# Altium project Ground Support.PrjPcb
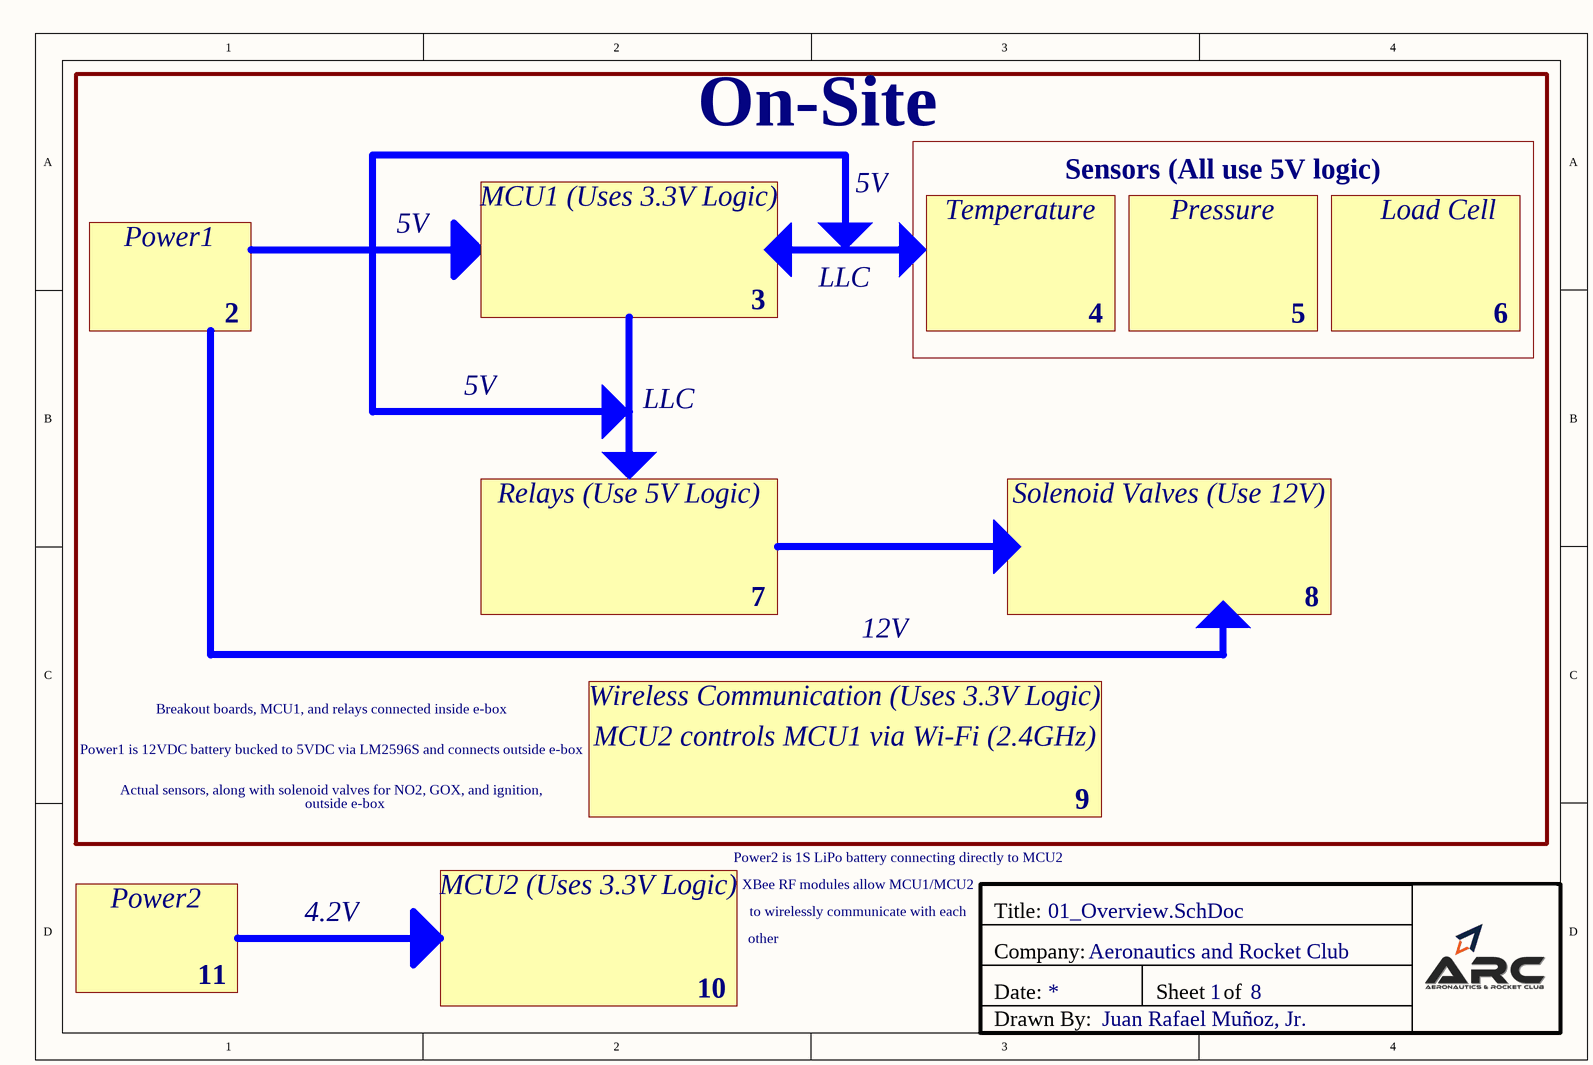
[diagram p0: 01_Overview.SchDoc]
Author: Juan Rafael Muñoz, Jr.; CompanyName: Aeronautics and Rocket Club
7 sheets, 23 parts. Net scope: flat (ports and power ports of the same name join across sheets).
Board file: GroundSupport.PcbDoc
Sheets:
  01_Overview.SchDoc
  02_Power1.SchDoc
  03_MCU1.SchDoc
  04_Temperature.SchDoc
  05_Pressure_and_LoadCell.SchDoc
  06_Relays_and_SolenoidValves.SchDoc
  09_Ebox_PhysicalConnections.SchDoc

## Sheet 01_Overview.SchDoc
size A4; DocumentNumber: 1; SheetNumber: 1; SheetTotal: 8

### Notes on the sheet
- On-Site
- MCU1 (Uses 3.3V Logic)
- 5V
- Temperature
- Sensors (All use 5V logic)
- Pressure
- Load Cell
- Power1
- LLC
- 2
- 3
- 4
- 5
- 6
- Relays (Use 5V Logic)
- Solenoid Valves (Use 12V)
- 7
- 8
- 12V
- Breakout boards, MCU1, and relays connected inside e-box
- Power1 is 12VDC battery bucked to 5VDC via LM2596S and connects outside e-box
- Wireless Communication (Uses 3.3V Logic)
- MCU2 controls MCU1 via Wi-Fi (2.4GHz)
- Actual sensors, along with solenoid valves for NO2, GOX, and ignition,
- outside e-box
- 9
- MCU2 (Uses 3.3V Logic)
- XBee RF modules allow MCU1/MCU2
- Power2 is 1S LiPo battery connecting directly to MCU2
- Power2
- 4.2V
- other
- to wirelessly communicate with each
- 11
- 10
- Title:
- Company:
- Date:
- Sheet
- of
- Drawn By:

## Sheet 02_Power1.SchDoc
size A4; DocumentNumber: 2; SheetNumber: 2; SheetTotal: 7
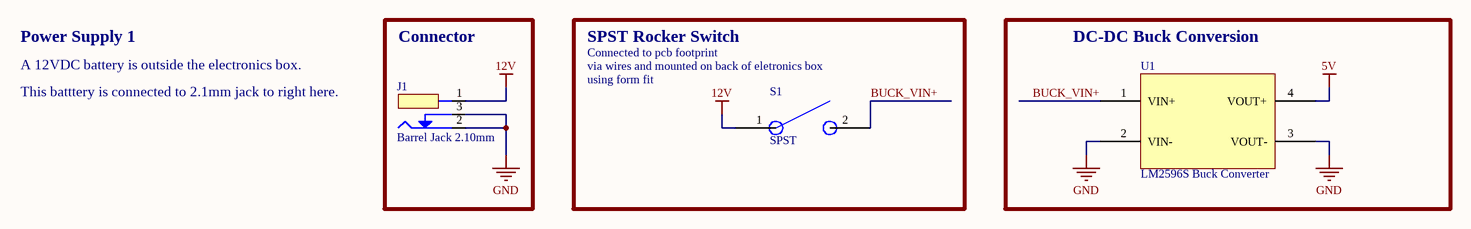
[diagram p1: 02_Power1.SchDoc]

### Parts
J1  Barrel Jack 2.10mm  [2.1mm Barrel Jack Connector]
S1  SPST  [SPST Switch]
U1  LM2596S Buck Converter  [LM2596S Buck Converter]

### Blocks framed on the sheet
Connector: J1
SPST Rocker Switch: S1
DC-DC Buck Conversion: U1

### Nets
5V: U1.4(VOUT+)
12V: J1.1 S1.1(+)
GND: J1.2 J1.3 U1.2(VIN-) U1.3(VOUT-)
BUCK_VIN+: S1.2(-) U1.1(VIN+)

### Notes on the sheet
- Power Supply 1
- (near J1) This batttery is connected to 2.1mm jack to right here.
- A 12VDC battery is outside the electronics box.
- Connected to pcb footprint
- via wires and mounted on back of eletronics box
- using form fit
- Title:
- Company:
- Date:
- Sheet
- of
- Drawn By:

### Library data of the parts
J1 = 54-00133: Power Barrel Connector Jack 2.10mm ID (0.083"), 5.50mm OD (0.217") Through Hole, Right Angle; Manufacturer: Tensility; Body Material: Copper Alloy; Gender: Male; Shielding: Unshielded; Voltage Rating: 48V; Current Rating: 6A; Supplier 1: Digi-Key; Manufacturer Part Number: 54-00133; RoHS: No; Category: Connectors; Stock 1: 8232; Pricing 1: 1=1.05000, 10=0.89100, 25=0.85440, 50=0.83620, 100=0.79990, 250=0.72720, 500=0.65448, 1000=0.58176, 2500=0.52722 (USD); Mounting Technology: Through Hole; Contact Plating: Silver; Contact Material: Bronze,Brass; Insulation Color: Black; Housing Material: PBT; Min Operating Temperature: -25°C; Max Operating Temperature: 85°C; Connector Type: Jack; Packaging: Bulk; Termination: Solder; ComponentLink1URL: http://www.tensility.com/pdffiles/54-00133.pdf?src-supplier=Digi-Key; ComponentLink1Description: http://www.tensility.com/pdffiles/54-00133.pdf?src-supplier=Digi-Key; Supplier Part Number 1: 839-1516-ND
S1 = SPST Switch
U1 = LM2596S Buck Converter: Product parameters: input voltage is 4.0V - 40V, output voltage is 1.25V - 37V, output current is 2A (normal and stable) and 3A max, conversion efficiency 92% (highest), output ripple under 30mV, switching frequency 150KHz, operating temperature is -45 to 85 degree Celsius / Simple to operate: the voltmeter can be turned off, and the switch can be turned off by pressing and holding the switch for more than 1 second and less than 4 seconds, once the voltmeter is turned off, simply press the switch to turn on the voltmeter / Easy to use: with terminal block, no soldering iron is also convenient to use, and retain the wire bond point (the input voltage must be higher than the voltage to be output by 1v or more) / Output current: the maximum output current can be as high as 3A, the recommended working current is about 2A, more than 2A plus heat sink / Nice design: with 150KHz internal oscillation frequency, features low power consumption and high efficiency; When the output voltage cannot be adjusted and is always equal to the input voltage, please turn the potentiometer counterclockwise for more than 10 turns, and then use the module to adjust the voltage normally; This is because when the module leaves the factory, the default output voltage is about 20V; Manufacturer: Frienda; Manufacturer Part Number: Frienda-Power Converters-01; Input Voltage: 4.0-40.0V; Output Voltage: 1.25-37.0V; Supplier: Amazon; RoHS: Unavailable; Category: DC-DC Buck Conversion; Stock: 4; Pricing: 13.99; Output Current: 2A; Max Output Current: 3A; Frequency: 150kHz; Length: 7.05in; Width: 4.72in; Height: 0.83in; Operating Temperature: -40-+85 deg C; Supplier Part Number: B081N6WWJS

## Sheet 03_MCU1.SchDoc
size A4; DocumentNumber: 3; SheetNumber: 3; SheetTotal: 7
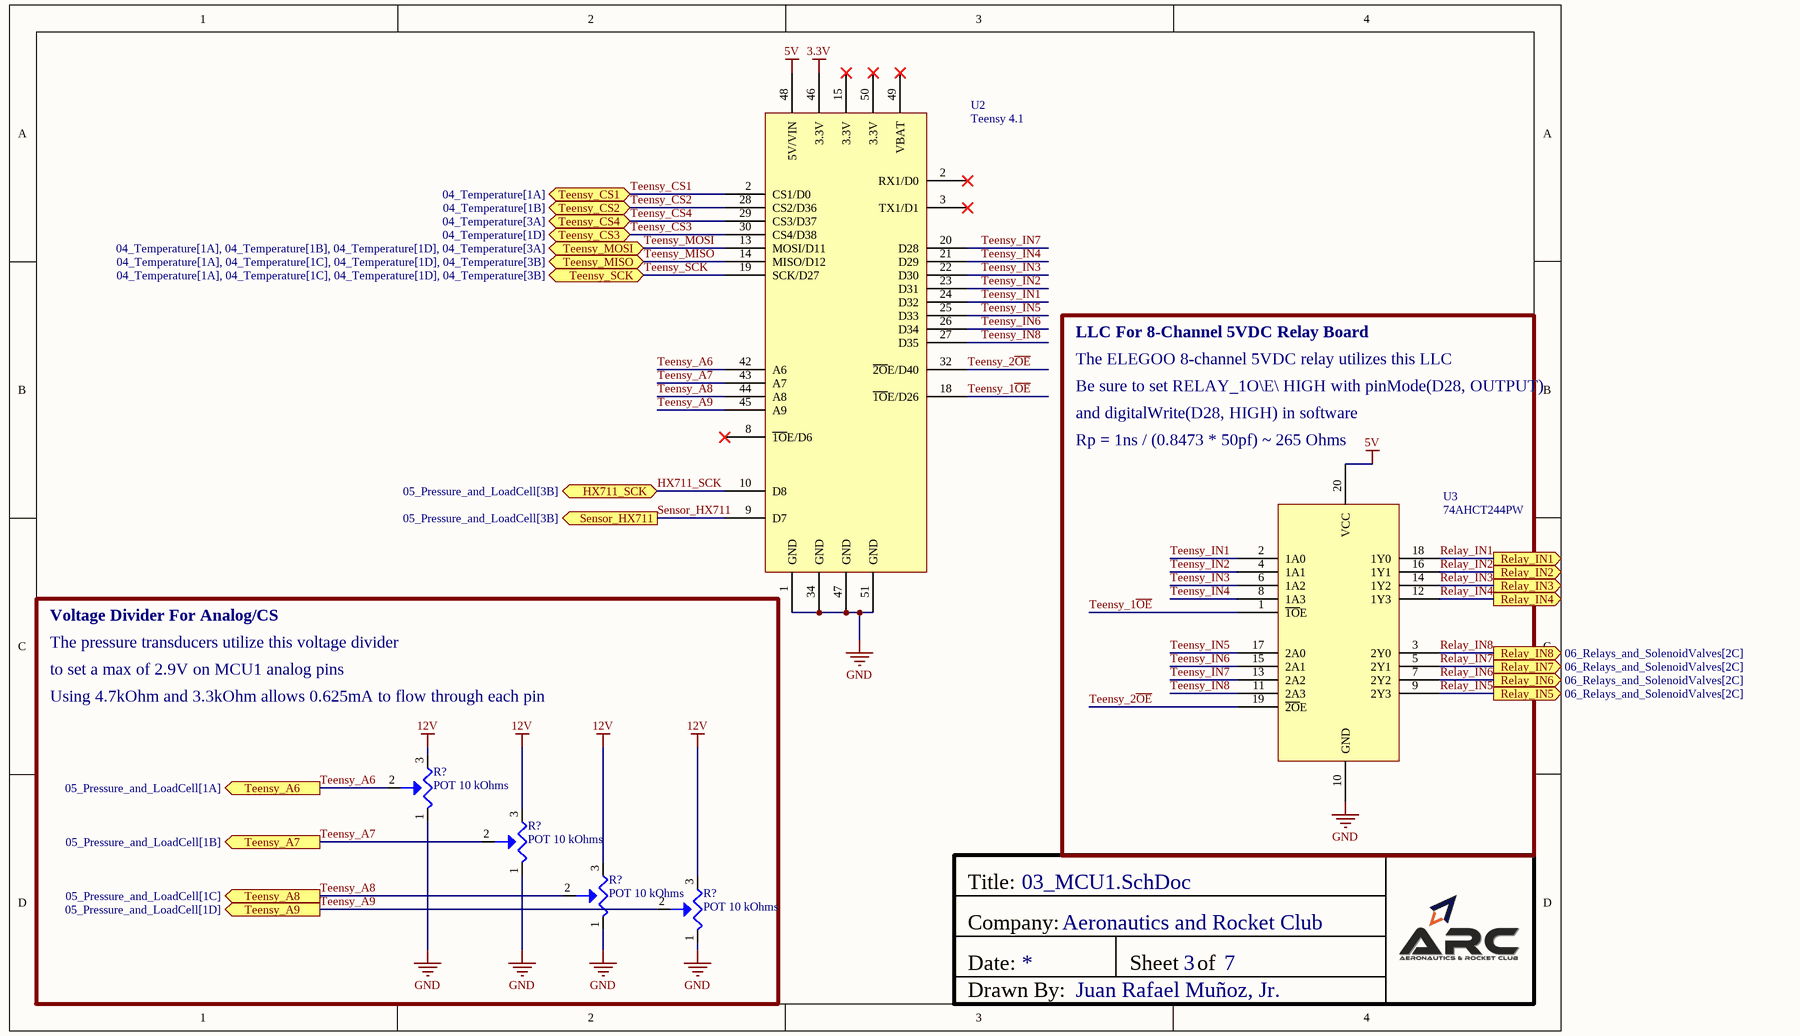
[diagram p2: 03_MCU1.SchDoc]

### Parts
(Parts that share a designator on the sheet are numbered #1, #2 ... from top to bottom, then left to right.)
R?#1  POT 10 kOhms  [3296WL 10K POT]
R?#2  POT 10 kOhms  [3296WL 10K POT]
R?#3  POT 10 kOhms  [3296WL 10K POT]
R?#4  POT 10 kOhms  [3296WL 10K POT]
U2  Teensy 4.1  [Teensy 4.1]
U3  74AHCT244PW  [74AHCT244PW]

### Ports
HX711_SCK (bidir, see 05_Pressure_and_LoadCell[3B]), Relay_IN1 (out, see 06_Relays_and_SolenoidValves[2C]), Relay_IN2 (out, see 06_Relays_and_SolenoidValves[2C]), Relay_IN3 (out, see 06_Relays_and_SolenoidValves[2C]), Relay_IN4 (out, see 06_Relays_and_SolenoidValves[2C]), Relay_IN5 (out, see 06_Relays_and_SolenoidValves[2C]), Relay_IN6 (out, see 06_Relays_and_SolenoidValves[2C]), Relay_IN7 (out, see 06_Relays_and_SolenoidValves[2C]), Relay_IN8 (out, see 06_Relays_and_SolenoidValves[2C]), Sensor_HX711 (out, see 05_Pressure_and_LoadCell[3B]), Teensy_A6 (out, see 05_Pressure_and_LoadCell[1A]), Teensy_A7 (out, see 05_Pressure_and_LoadCell[1B]), Teensy_A8 (out, see 05_Pressure_and_LoadCell[1C]), Teensy_A9 (out, see 05_Pressure_and_LoadCell[1D]), Teensy_CS1 (bidir, see 04_Temperature[1A]), Teensy_CS2 (bidir, see 04_Temperature[1B]), Teensy_CS3 (bidir, see 04_Temperature[1D]), Teensy_CS4 (bidir, see 04_Temperature[3A]), Teensy_MISO (bidir, see 04_Temperature[1A], 04_Temperature[1C], 04_Temperature[1D], 04_Temperature[3B]), Teensy_MOSI (bidir, see 04_Temperature[1A], 04_Temperature[1B], 04_Temperature[1D], 04_Temperature[3A]), Teensy_SCK (bidir, see 04_Temperature[1A], 04_Temperature[1C], 04_Temperature[1D], 04_Temperature[3B])

### Nets
3.3V: U2.46(3.3V)
5V: U2.48(5V/VIN) U3.20(VCC)
12V: R?#1.3 R?#2.3 R?#3.3 R?#4.3
GND: R?#1.1 R?#2.1 R?#3.1 R?#4.1 U2.1(GND) U2.34(GND) U2.47(GND) U2.51(GND) U3.10(GND)
HX711_SCK: U2.10(D8) ; port HX711_SCK
Relay_IN1: U3.18(1Y0) ; port Relay_IN1
Relay_IN2: U3.16(1Y1) ; port Relay_IN2
Relay_IN3: U3.14(1Y2) ; port Relay_IN3
Relay_IN4: U3.12(1Y3) ; port Relay_IN4
Relay_IN5: U3.9(2Y3) ; port Relay_IN5
Relay_IN6: U3.7(2Y2) ; port Relay_IN6
Relay_IN7: U3.5(2Y1) ; port Relay_IN7
Relay_IN8: U3.3(2Y0) ; port Relay_IN8
Sensor_HX711: U2.9(D7) ; port Sensor_HX711
Teensy_1~{OE}: U2.18(~{1O}E/D26) U3.1(~{1O}E)
Teensy_2~{OE}: U2.32(~{2O}E/D40) U3.19(~{2O}E)
Teensy_A6: R?#1.2 U2.42(A6) ; port Teensy_A6
Teensy_A7: R?#2.2 U2.43(A7) ; port Teensy_A7
Teensy_A8: R?#3.2 U2.44(A8) ; port Teensy_A8
Teensy_A9: R?#4.2 U2.45(A9) ; port Teensy_A9
Teensy_CS1: U2.2(CS1/D0) ; port Teensy_CS1
Teensy_CS2: U2.28(CS2/D36) ; port Teensy_CS2
Teensy_CS3: U2.30(CS4/D38) ; port Teensy_CS3
Teensy_CS4: U2.29(CS3/D37) ; port Teensy_CS4
Teensy_IN1: U2.24(D32) U3.2(1A0)
Teensy_IN2: U2.23(D31) U3.4(1A1)
Teensy_IN3: U2.22(D30) U3.6(1A2)
Teensy_IN4: U2.21(D29) U3.8(1A3)
Teensy_IN5: U2.25(D33) U3.17(2A0)
Teensy_IN6: U2.26(D34) U3.15(2A1)
Teensy_IN7: U2.20(D28) U3.13(2A2)
Teensy_IN8: U2.27(D35) U3.11(2A3)
Teensy_MISO: U2.14(MISO/D12) ; port Teensy_MISO
Teensy_MOSI: U2.13(MOSI/D11) ; port Teensy_MOSI
Teensy_SCK: U2.19(SCK/D27) ; port Teensy_SCK

Not connected (* = marked no-connect by the designer): U2 3(TX1/D1)* 8(~{1O}E/D6)* 15(3.3V)* 49(VBAT)* 50(3.3V)*

### Notes on the sheet
- The ELEGOO 8-channel 5VDC relay utilizes this LLC
- LLC For 8-Channel 5VDC Relay Board
- Be sure to set RELAY_1O\E\ HIGH with pinMode(D28, OUTPUT)
- and digitalWrite(D28, HIGH) in software
- Rp = 1ns / (0.8473 * 50pf) ~ 265 Ohms
- Voltage Divider For Analog/CS
- The pressure transducers utilize this voltage divider
- to set a max of 2.9V on MCU1 analog pins
- Using 4.7kOhm and 3.3kOhm allows 0.625mA to flow through each pin
- Title:
- Company:
- Date:
- Sheet
- of
- Drawn By:

### Library data of the parts
R?#1-R?#4 = 3296W-1-103LF: 10 kOhms 0.5W, 1/2W PC Pins Through Hole Trimmer Potentiometer Cermet 25.0 Turn Top Adjustment; Manufacturer: Bourns; Tolerance: 10%; Actuator Orientation: Vertical; Actuator Type: SCREW; Number of Turns: 25; Power: 500mW; Rated Temperature: 70°C; Value: 10kR; Resistance Law: Linear; Rotational Angle: 9000°; Temperature Coefficient: -100100ppm/°C; Lead Diameter: 0.51mm; Lead Length: 6.4mm; Package Height: 10.03mm; Package Length: 9.53mm; Package Width: 4.83mm; Supplier: Digi-Key; Supplier Part Number: 3296W-103LF-ND; Manufacturer Part Number: 3296W-1-103LF; RoHS: Yes; Category: Variable Resistors and Potentiometers; Stock: 20859; Pricing: 1=2.43000, 10=2.13800, 25=1.91680, 50=1.84320, 100=1.76950, 250=1.69580, 500=1.40088, 1000=1.32714, 5000=1.10595 (USD); Mounting Technology: Through Hole; Pins: 3; Package Shape: Rectangular; Case/Package: 3819; Terminal Finish: Tin; Min Operating Temperature: -55°C; Max Operating Temperature: 125°C; JESD-609 Code: e3; Resistor Type: TRIMMER; Construction: Trimmer Pot; Package Style: PCB MountMeter; Packaging: Rail/Tube; Technology: CERMET; Termination: Wire; RoHS Compliant: Yes; Reach SVHC Compliant: No; ComponentLink1URL: https://datasheet.ciiva.com:443/pdfs/VipMasterIC/IC/BOUR/BOUR-S-A0008796795/BOUR-S-A0008796795-1.pdf?src-supplier=IHS+Markit; ComponentLink1Description: https://datasheet.ciiva.com:443/pdfs/VipMasterIC/IC/BOUR/BOUR-S-A0008796795/BOUR-S-A0008796795-1.pdf?src-supplier=IHS+Markit; ComponentLink2URL: https://datasheet.ciiva.com/19454/853572-19454866.pdf?src-supplier=Jameco; ComponentLink2Description: https://datasheet.ciiva.com/19454/853572-19454866.pdf?src-supplier=Jameco; ComponentLink3URL: https://datasheet.ciiva.com/14173/ew3296-dat-e-14173022.pdf?src-supplier=Distrelec; ComponentLink3Description: https://datasheet.ciiva.com/14173/ew3296-dat-e-14173022.pdf?src-supplier=Distrelec; ComponentLink4URL: https://datasheet.ciiva.com/18411/70153578-18411561.pdf?src-supplier=Allied+Electronics; ComponentLink4Description: https://datasheet.ciiva.com/18411/70153578-18411561.pdf?src-supplier=Allied+Electronics; ComponentLink5URL: https://datasheet.ciiva.com/1131/1815117-1131273.pdf?src-supplier=Element14; ComponentLink5Description: https://datasheet.ciiva.com/1131/1815117-1131273.pdf?src-supplier=Element14; ComponentLink6URL: https://datasheet.ciiva.com/3266/3296-3266187.pdf?src-supplier=Avnet; ComponentLink6Description: https://datasheet.ciiva.com/3266/3296-3266187.pdf?src-supplier=Avnet; ComponentLink7URL: https://datasheet.ciiva.com/2156/3296-2156893.pdf?src-supplier=Digi-Key; ComponentLink7Description: https://datasheet.ciiva.com/2156/3296-2156893.pdf?src-supplier=Digi-Key
U2 = Teensy 4.1: RT1062 Teensy 4.1 - ARM® Cortex®-M7 MCU 32-Bit Embedded Evaluation Board 600 MHz 100 mA RTC Built-in microSD Card reader Arduino IDE compatible; Manufacturer: SparkFun; Manufacturer Part Number: DEV-16996; Supplier 1: Digi-Key; RoHS: No; Category: Embedded Processors and Controllers; Stock 1: 300; Pricing 1: 1=31.88000 (USD); Supplier Part Number 1: 1568-DEV-16996-ND
U3 = 74AHCT244PW: Octal Tri-State Buffer NON-INVERT 5.5V 20TSSOP; Manufacturer: NXP Semiconductors; Manufacturer Part Number: 74AHCT244PW,118; Number of Channels: 8; Operating Supply Voltage: 5V; Propagation Delay: 8.4ns; Min Supply Voltage: 4.5V; Logic Function: Buffer,Inverting; Number of Elements: 2; Number of Bits per Element: 4; High Level Output Current: -8mA; Low Level Output Current: 8mA; Polarity: Non-Inverting; Turn-On Delay Time: 14.5ns; Quiescent Current: 4uA; Output Type: 3-STATE; Supplier 1: Digi-Key; RoHS: Yes; Category: Uncategorized; Mounting Technology: Surface Mount; Case/Package: TSSOP; Pins: 20; Contact Plating: Gold; Min Operating Temperature: -40°C; Max Operating Temperature: 125°C; Number of Inputs: 8; Number of Outputs: 8; Packaging: Tape and Reel; Max Supply Voltage: 5.5V; Package Quantity: 2500; Number of Input Lines: 8; Number of Output Lines: 8; Series: 74AHCT; Technology: CMOS; Radiation Hardening: No; RoHS Compliant: Yes; Lead Free: Lead Free; ComponentLink1URL: https://datasheet.ciiva.com/1832/74ahc-ahct244-1832788.pdf?src-supplier=Digi-Key; ComponentLink1Description: https://datasheet.ciiva.com/1832/74ahc-ahct244-1832788.pdf?src-supplier=Digi-Key; ComponentLink2URL: https://datasheet.ciiva.com/1832/74ahc-ahct244-1832789.pdf?src-supplier=Digi-Key; ComponentLink2Description: https://datasheet.ciiva.com/1832/74ahc-ahct244-1832789.pdf?src-supplier=Digi-Key; ComponentLink3URL: https://datasheet.ciiva.com/1832/74ahc-ahct244-1832790.pdf?src-supplier=Digi-Key; ComponentLink3Description: https://datasheet.ciiva.com/1832/74ahc-ahct244-1832790.pdf?src-supplier=Digi-Key; ComponentLink4URL: https://datasheet.ciiva.com/1832/74ahc-ahct244-1832792.pdf?src-supplier=Digi-Key; ComponentLink4Description: https://datasheet.ciiva.com/1832/74ahc-ahct244-1832792.pdf?src-supplier=Digi-Key; Supplier Part Number 1: 1727-4002-2-ND

## Sheet 04_Temperature.SchDoc
size A4; DocumentNumber: 4; SheetNumber: 4; SheetTotal: 7
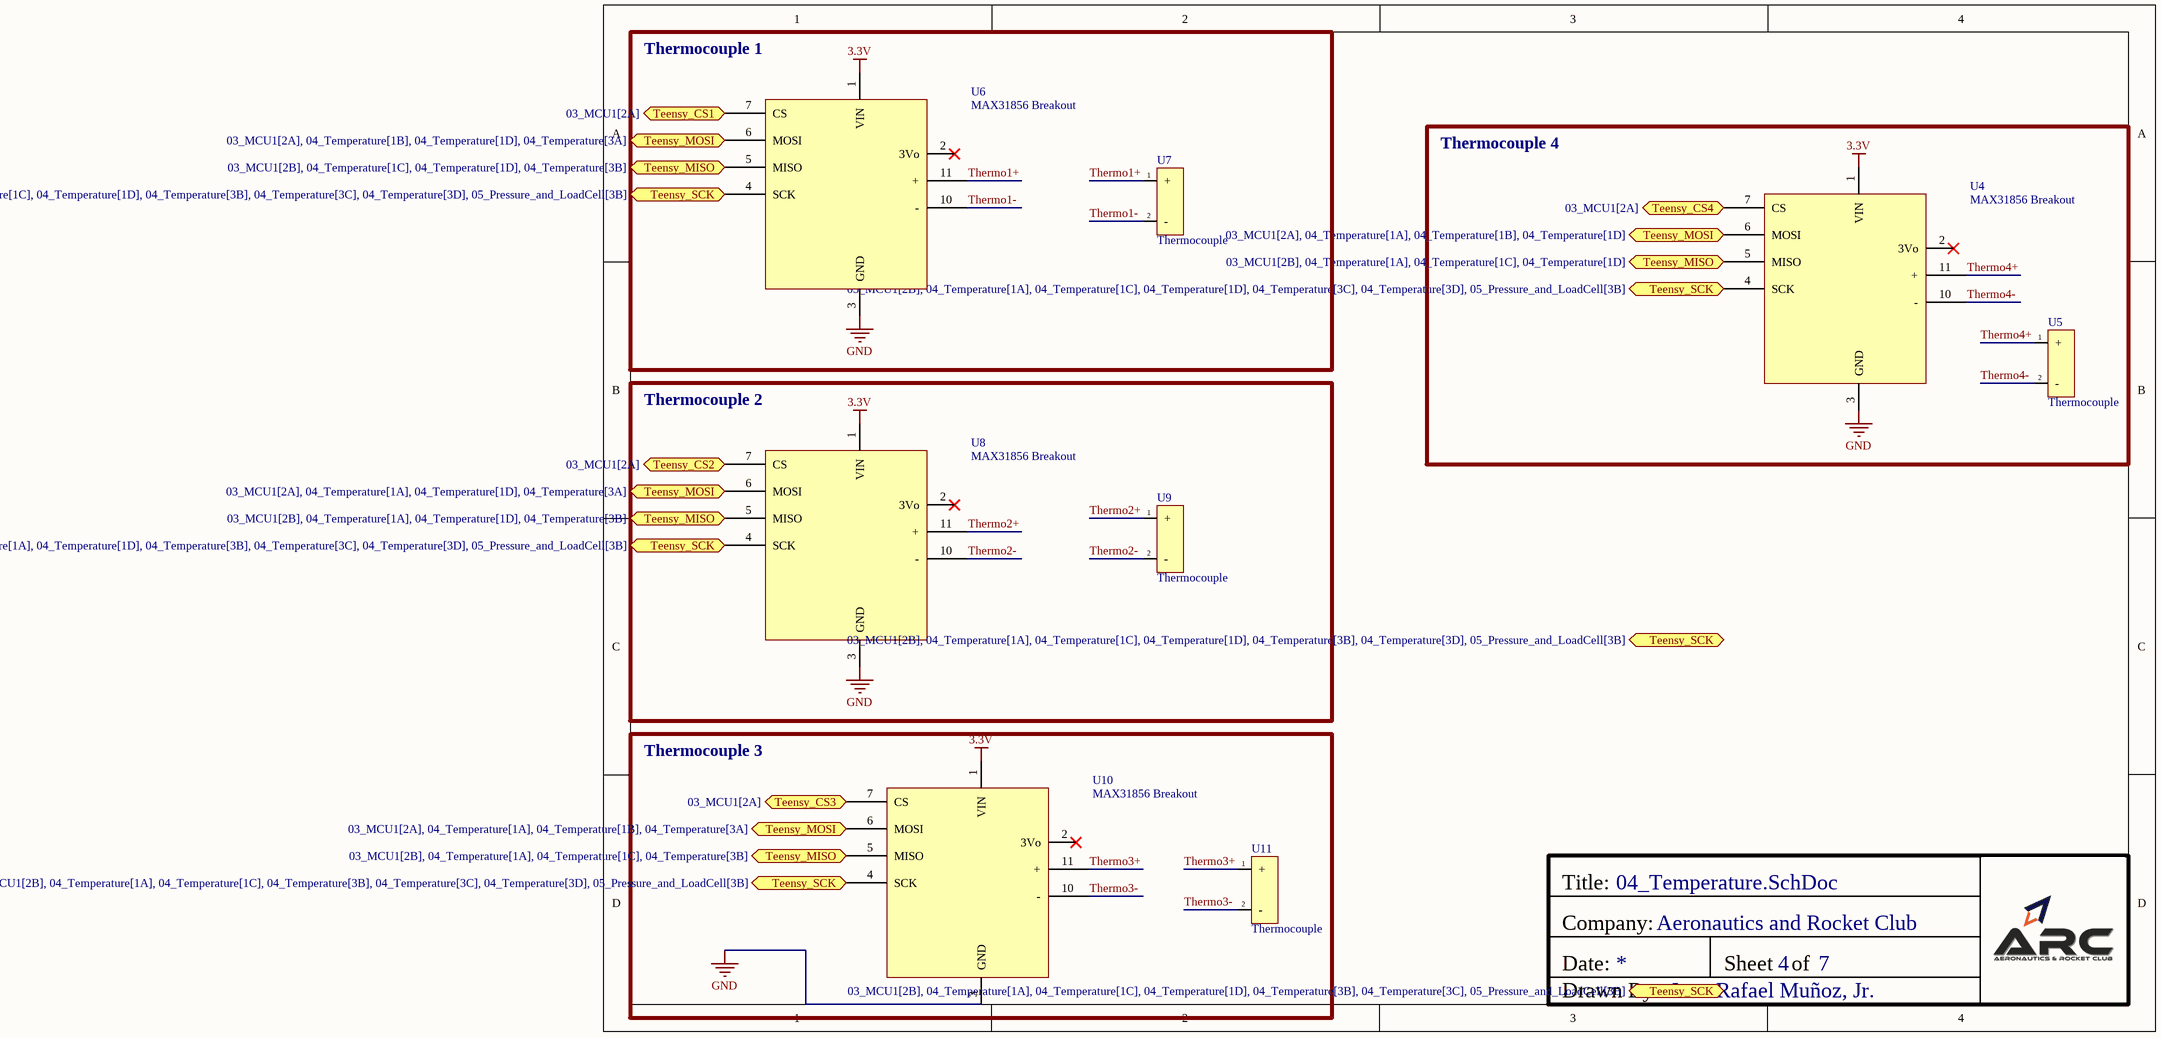
[diagram p3: 04_Temperature.SchDoc]

### Parts
U4  MAX31856 Breakout  [MAX31856 Breakout]
U5  Thermocouple  [THERMOCOUPLE]
U6  MAX31856 Breakout  [MAX31856 Breakout]
U7  Thermocouple  [THERMOCOUPLE]
U8  MAX31856 Breakout  [MAX31856 Breakout]
U9  Thermocouple  [THERMOCOUPLE]
U10  MAX31856 Breakout  [MAX31856 Breakout]
U11  Thermocouple  [THERMOCOUPLE]

### Blocks framed on the sheet
Thermocouple 1: U6 U7
Thermocouple 4: U4 U5
Thermocouple 2: U8 U9
Thermocouple 3: U10 U11

### Ports
Teensy_CS1 (bidir, see 03_MCU1[2A]), Teensy_CS2 (bidir, see 03_MCU1[2A]), Teensy_CS3 (bidir, see 03_MCU1[2A]), Teensy_CS4 (bidir, see 03_MCU1[2A]), Teensy_MISO (bidir, see 03_MCU1[2B], 04_Temperature[1A], 04_Temperature[1C], 04_Temperature[1D]), Teensy_MISO (bidir, see 03_MCU1[2B], 04_Temperature[1A], 04_Temperature[1C], 04_Temperature[3B]), Teensy_MISO (bidir, see 03_MCU1[2B], 04_Temperature[1A], 04_Temperature[1D], 04_Temperature[3B]), Teensy_MISO (bidir, see 03_MCU1[2B], 04_Temperature[1C], 04_Temperature[1D], 04_Temperature[3B]), Teensy_MOSI (bidir, see 03_MCU1[2A], 04_Temperature[1A], 04_Temperature[1B], 04_Temperature[1D]), Teensy_MOSI (bidir, see 03_MCU1[2A], 04_Temperature[1A], 04_Temperature[1B], 04_Temperature[3A]), Teensy_MOSI (bidir, see 03_MCU1[2A], 04_Temperature[1A], 04_Temperature[1D], 04_Temperature[3A]), Teensy_MOSI (bidir, see 03_MCU1[2A], 04_Temperature[1B], 04_Temperature[1D], 04_Temperature[3A]), Teensy_SCK (bidir, see 03_MCU1[2B], 04_Temperature[1A], 04_Temperature[1C], 04_Temperature[1D], 04_Temperature[3B], 04_Temperature[3C], 05_Pressure_and_LoadCell[3B]), Teensy_SCK (bidir, see 03_MCU1[2B], 04_Temperature[1A], 04_Temperature[1C], 04_Temperature[1D], 04_Temperature[3B], 04_Temperature[3D], 05_Pressure_and_LoadCell[3B]), Teensy_SCK (bidir, see 03_MCU1[2B], 04_Temperature[1A], 04_Temperature[1C], 04_Temperature[1D], 04_Temperature[3C], 04_Temperature[3D], 05_Pressure_and_LoadCell[3B]), Teensy_SCK (bidir, see 03_MCU1[2B], 04_Temperature[1A], 04_Temperature[1C], 04_Temperature[3B], 04_Temperature[3C], 04_Temperature[3D], 05_Pressure_and_LoadCell[3B]), Teensy_SCK (bidir, see 03_MCU1[2B], 04_Temperature[1A], 04_Temperature[1D], 04_Temperature[3B], 04_Temperature[3C], 04_Temperature[3D], 05_Pressure_and_LoadCell[3B]), Teensy_SCK (bidir, see 03_MCU1[2B], 04_Temperature[1C], 04_Temperature[1D], 04_Temperature[3B], 04_Temperature[3C], 04_Temperature[3D], 05_Pressure_and_LoadCell[3B])

### Nets
3.3V: U4.1(VIN) U6.1(VIN) U8.1(VIN) U10.1(VIN)
GND: U4.3(GND) U6.3(GND) U8.3(GND) U10.3(GND)
Teensy_CS1: U6.7(CS) ; port Teensy_CS1
Teensy_CS2: U8.7(CS) ; port Teensy_CS2
Teensy_CS3: U10.7(CS) ; port Teensy_CS3
Teensy_CS4: U4.7(CS) ; port Teensy_CS4
Teensy_MISO: U4.5(MISO) U6.5(MISO) U8.5(MISO) U10.5(MISO) ; port Teensy_MISO
Teensy_MOSI: U4.6(MOSI) U6.6(MOSI) U8.6(MOSI) U10.6(MOSI) ; port Teensy_MOSI
Teensy_SCK: U4.4(SCK) U6.4(SCK) U8.4(SCK) U10.4(SCK) ; port Teensy_SCK
Thermo1+: U6.11(+) U7.1(+)
Thermo1-: U6.10(-) U7.2(-)
Thermo2+: U8.11(+) U9.1(+)
Thermo2-: U8.10(-) U9.2(-)
Thermo3+: U10.11(+) U11.1(+)
Thermo3-: U10.10(-) U11.2(-)
Thermo4+: U4.11(+) U5.1(+)
Thermo4-: U4.10(-) U5.2(-)

Not connected (* = marked no-connect by the designer): U4 2(3Vo)*; U6 2(3Vo)*; U8 2(3Vo)*; U10 2(3Vo)*

### Notes on the sheet
- Title:
- Company:
- Date:
- Sheet
- of
- Drawn By:

### Library data of the parts
U4 U6 U8 U10 = MAX31856 Breakout: Thermocouple amplifier works with any K, J, N, R, S, T, E, or B type thermocouple -210°C to +1800°C output in 0.0078125° resolution 3.3 to 5v power supply and logic level compliant SPI protocol

## Sheet 05_Pressure_and_LoadCell.SchDoc
size A4; DocumentNumber: 5; SheetNumber: 5; SheetTotal: 7
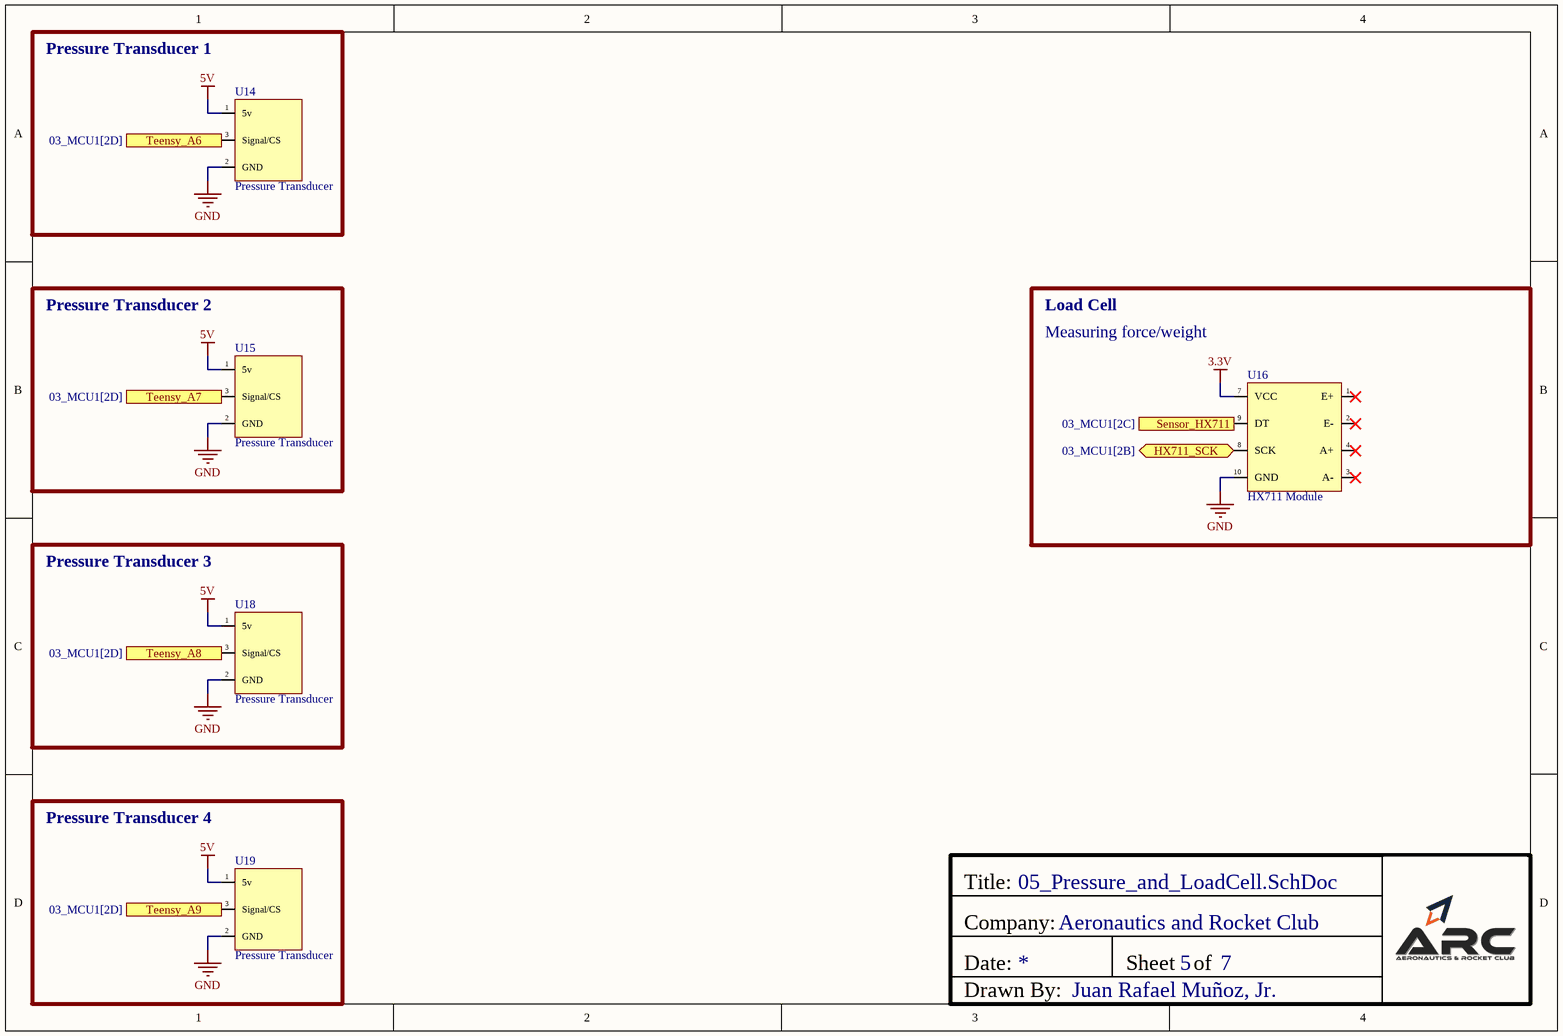
[diagram p4: 05_Pressure_and_LoadCell.SchDoc]

### Parts
U14  Pressure Transducer  [3-PIN AVIATION CONNECTOR]
U15  Pressure Transducer  [3-PIN AVIATION CONNECTOR]
U16  HX711 Module  [HX711 Module]
U18  Pressure Transducer  [3-PIN AVIATION CONNECTOR]
U19  Pressure Transducer  [3-PIN AVIATION CONNECTOR]

### Blocks framed on the sheet
Pressure Transducer 1: U14
Pressure Transducer 2: U15
Pressure Transducer 3: U18
Pressure Transducer 4: U19

### Ports
HX711_SCK (bidir, see 03_MCU1[2B]), Sensor_HX711 (in, see 03_MCU1[2C]), Teensy_A6 (in, see 03_MCU1[2D]), Teensy_A7 (in, see 03_MCU1[2D]), Teensy_A8 (in, see 03_MCU1[2D]), Teensy_A9 (in, see 03_MCU1[2D])

### Nets
3.3V: U16.7(VCC)
5V: U14.1(5v) U15.1(5v) U18.1(5v) U19.1(5v)
GND: U14.2(GND) U15.2(GND) U16.10(GND) U18.2(GND) U19.2(GND)
HX711_SCK: U16.8(SCK) ; port HX711_SCK
Sensor_HX711: U16.9(DT) ; port Sensor_HX711
Teensy_A6: U14.3(Signal/CS) ; port Teensy_A6
Teensy_A7: U15.3(Signal/CS) ; port Teensy_A7
Teensy_A8: U18.3(Signal/CS) ; port Teensy_A8
Teensy_A9: U19.3(Signal/CS) ; port Teensy_A9

Not connected (* = marked no-connect by the designer): U16 1(E+)* 2(E-)* 3(A-)* 4(A+)*

### Notes on the sheet
- Load Cell
- Measuring force/weight
- Title:
- Company:
- Date:
- Sheet
- of
- Drawn By:

## Sheet 06_Relays_and_SolenoidValves.SchDoc
size A4; Engineer: Juan Rafael Munoz, Jr.; DocumentNumber: 6; SheetNumber: 6; SheetTotal: 7
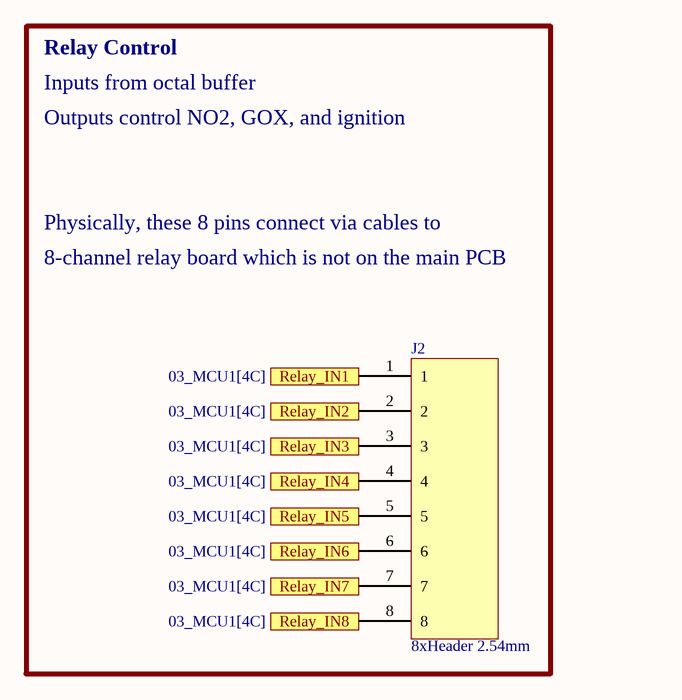
[diagram p5: 06_Relays_and_SolenoidValves.SchDoc]

### Parts
J2  8xHeader 2.54mm  [1x8HeaderPins]

### Ports
Relay_IN1 (in, see 03_MCU1[4C]), Relay_IN2 (in, see 03_MCU1[4C]), Relay_IN3 (in, see 03_MCU1[4C]), Relay_IN4 (in, see 03_MCU1[4C]), Relay_IN5 (in, see 03_MCU1[4C]), Relay_IN6 (in, see 03_MCU1[4C]), Relay_IN7 (in, see 03_MCU1[4C]), Relay_IN8 (in, see 03_MCU1[4C])

### Nets
Relay_IN1: J2.1 ; port Relay_IN1
Relay_IN2: J2.2 ; port Relay_IN2
Relay_IN3: J2.3 ; port Relay_IN3
Relay_IN4: J2.4 ; port Relay_IN4
Relay_IN5: J2.5 ; port Relay_IN5
Relay_IN6: J2.6 ; port Relay_IN6
Relay_IN7: J2.7 ; port Relay_IN7
Relay_IN8: J2.8 ; port Relay_IN8

### Notes on the sheet
- Relay Control
- Inputs from octal buffer
- Outputs control NO2, GOX, and ignition
- Physically, these 8 pins connect via cables to
- 8-channel relay board which is not on the main PCB
- Title:
- Company:
- Date:
- Sheet
- of
- Drawn By:

## Sheet 09_Ebox_PhysicalConnections.SchDoc
size A4; DocumentNumber: 7; SheetNumber: 7; SheetTotal: 7
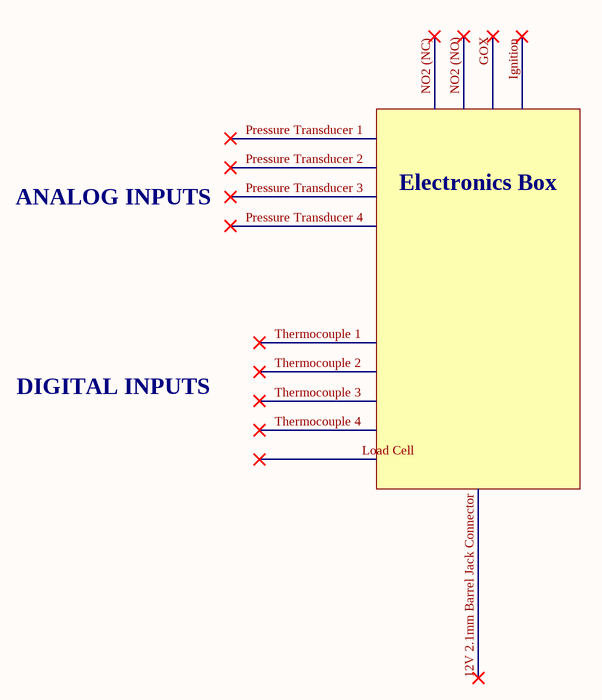
[diagram p6: 09_Ebox_PhysicalConnections.SchDoc]

### Notes on the sheet
- NO2 (NC)
- NO2 (NO)
- GOX
- Ignition
- Pressure Transducer 1
- Pressure Transducer 2
- ANALOG INPUTS
- Pressure Transducer 3
- Pressure Transducer 4
- Electronics Box
- DIGITAL INPUTS
- Thermocouple 1
- Thermocouple 2
- Thermocouple 3
- Thermocouple 4
- Load Cell
- 12V 2.1mm Barrel Jack Connector
- Title:
- Company:
- Date:
- Sheet
- of
- Drawn By:

## Nets that join several sheets
3.3V: 03_MCU1 (U2.46), 04_Temperature (U4.1 U6.1 U8.1 U10.1), 05_Pressure_and_LoadCell (U16.7)
5V: 02_Power1 (U1.4), 03_MCU1 (U2.48 U3.20), 05_Pressure_and_LoadCell (U14.1 U15.1 U18.1 U19.1)
12V: 02_Power1 (J1.1 S1.1), 03_MCU1 (R?#1.3 R?#2.3 R?#3.3 R?#4.3)
GND: 02_Power1 (J1.2 J1.3 U1.2 U1.3), 03_MCU1 (9 pins), 04_Temperature (U4.3 U6.3 U8.3 U10.3), 05_Pressure_and_LoadCell (5 pins)
HX711_SCK: 03_MCU1 (U2.10), 05_Pressure_and_LoadCell (U16.8)
Relay_IN1: 03_MCU1 (U3.18), 06_Relays_and_SolenoidValves (J2.1)
Relay_IN2: 03_MCU1 (U3.16), 06_Relays_and_SolenoidValves (J2.2)
Relay_IN3: 03_MCU1 (U3.14), 06_Relays_and_SolenoidValves (J2.3)
Relay_IN4: 03_MCU1 (U3.12), 06_Relays_and_SolenoidValves (J2.4)
Relay_IN5: 03_MCU1 (U3.9), 06_Relays_and_SolenoidValves (J2.5)
Relay_IN6: 03_MCU1 (U3.7), 06_Relays_and_SolenoidValves (J2.6)
Relay_IN7: 03_MCU1 (U3.5), 06_Relays_and_SolenoidValves (J2.7)
Relay_IN8: 03_MCU1 (U3.3), 06_Relays_and_SolenoidValves (J2.8)
Sensor_HX711: 03_MCU1 (U2.9), 05_Pressure_and_LoadCell (U16.9)
Teensy_A6: 03_MCU1 (R?#1.2 U2.42), 05_Pressure_and_LoadCell (U14.3)
Teensy_A7: 03_MCU1 (R?#2.2 U2.43), 05_Pressure_and_LoadCell (U15.3)
Teensy_A8: 03_MCU1 (R?#3.2 U2.44), 05_Pressure_and_LoadCell (U18.3)
Teensy_A9: 03_MCU1 (R?#4.2 U2.45), 05_Pressure_and_LoadCell (U19.3)
Teensy_CS1: 03_MCU1 (U2.2), 04_Temperature (U6.7)
Teensy_CS2: 03_MCU1 (U2.28), 04_Temperature (U8.7)
Teensy_CS3: 03_MCU1 (U2.30), 04_Temperature (U10.7)
Teensy_CS4: 03_MCU1 (U2.29), 04_Temperature (U4.7)
Teensy_MISO: 03_MCU1 (U2.14), 04_Temperature (U4.5 U6.5 U8.5 U10.5)
Teensy_MOSI: 03_MCU1 (U2.13), 04_Temperature (U4.6 U6.6 U8.6 U10.6)
Teensy_SCK: 03_MCU1 (U2.19), 04_Temperature (U4.4 U6.4 U8.4 U10.4)